# Altium schematic sheet ModeWork.SchDoc
size A
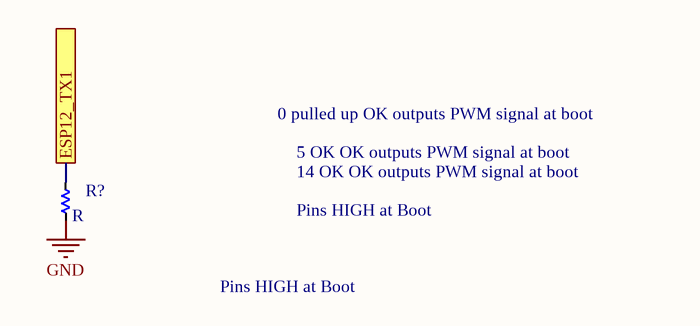
[diagram p0: ModeWork.SchDoc]

## Parts
R?  R  [RES-SMD-0603_BIG]

## Ports
ESP12_TX1

## Nets
GND: R?.2
ESP12_TX1: R?.1 ; port ESP12_TX1

## Notes on the sheet
- 0 pulled up OK outputs PWM signal at boot
- 5 OK OK outputs PWM signal at boot
- 14 OK OK outputs PWM signal at boot
- Pins HIGH at Boot